# EAGLE schematic Masterprop (EAGLE 9.7.0)
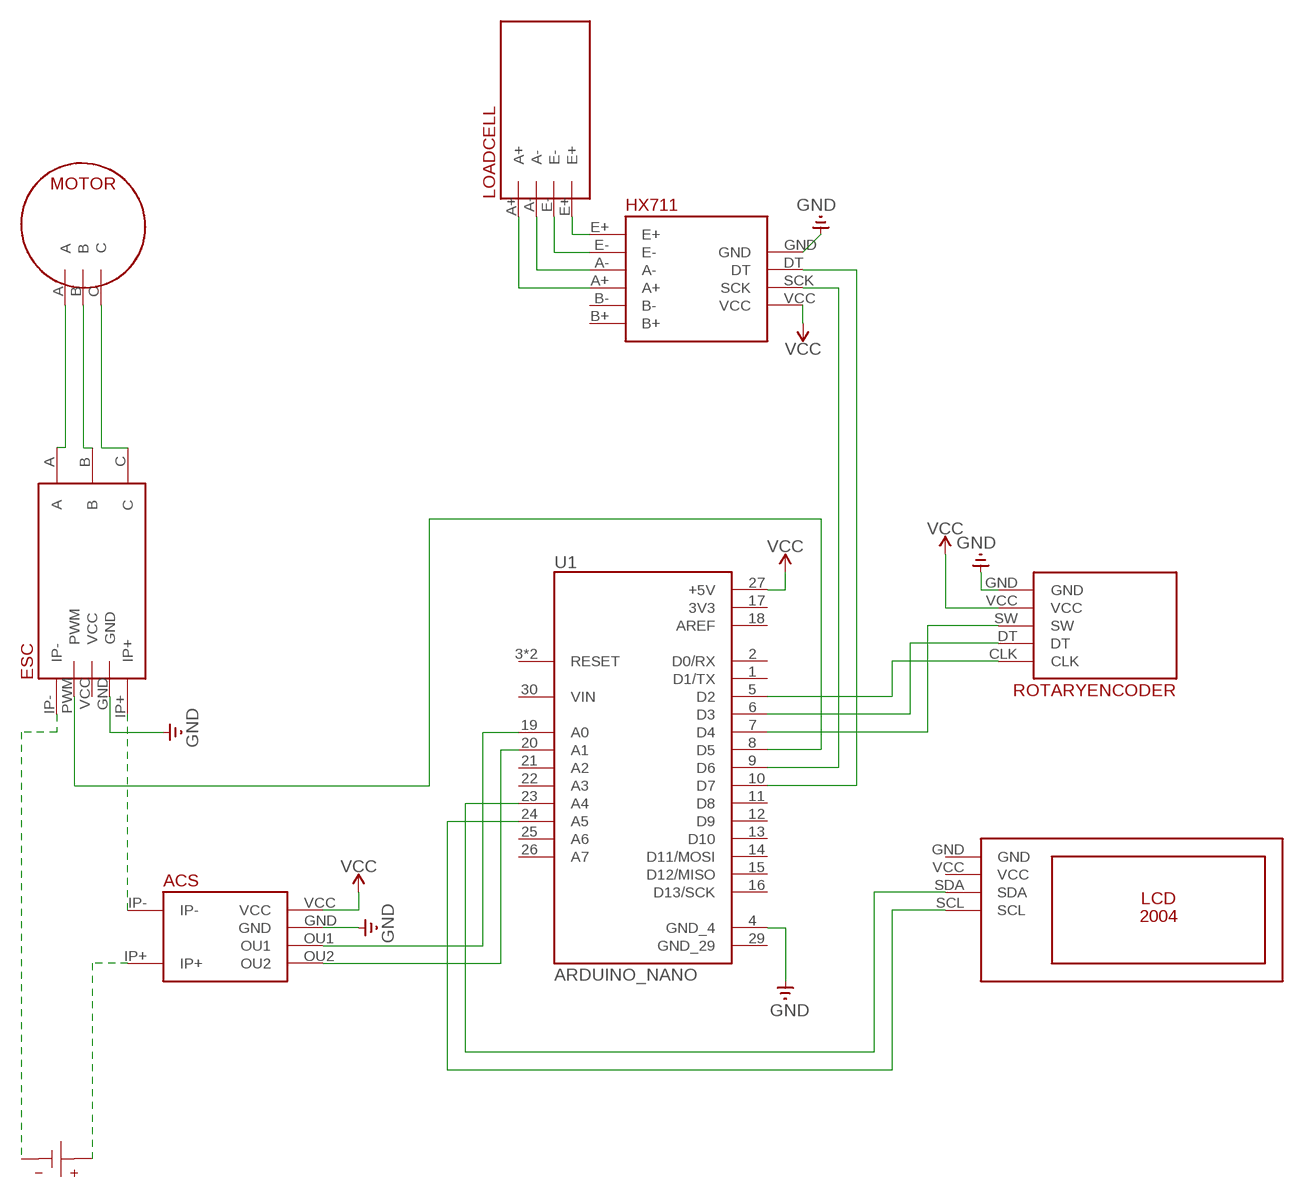
[diagram p0: schematic, sheet 1]

## Parts
BT1  KEYSTONE_1042  [1042]
U1  ARDUINO_NANO  [MODULE_ARDUINO_NANO]
U$1  ACSACS-FOOTPRINT  [ACS-FOOTPRINT]
U$2  ESCESC-FOOTPRINT  [ESC-FOOTPRINT]
U$3  HX711HX711-FOOTPRINT  [HX711-FOOTPRINT]
U$4  LOADCELLLOADCELL-FOOTPRINT  [LOADCELL-FOOTPRINT]
U$5  ROTARYENCODERROTARYENCODER-FOOTPRINT  [ROTARYENCODER-FOOTPRINT]
U$6  MOTORMOTOR-FOOTPRINT  [MOTOR-FOOTPRINT]
U$7  LCDLCD-FOOTPRINT  [LCD-FOOTPRINT]

## Nets
+: BT1.P(+) U$1.IP+
-: BT1.N(-) U$2.IP-
GND: U1.4(GND_4) U$1.GND U$2.GND U$3.GND U$5.GND
N$1: U1.8(D5) U$2.PWM
N$2: U1.5(D2) U$5.CLK
N$3: U1.10(D7) U$3.DT
N$4: U1.9(D6) U$3.SCK
N$5: U$1.IP- U$2.IP+
N$8: U$3.E+ U$4.E+
N$9: U$3.E- U$4.E-
N$10: U$3.A- U$4.A-
N$11: U$3.A+ U$4.A+
N$12: U$2.C U$6.C
N$13: U$2.B U$6.B
N$14: U$2.A U$6.A
N$15: U1.6(D3) U$5.DT
N$16: U1.7(D4) U$5.SW
N$17: U1.19(A0) U$1.OU1
N$18: U1.20(A1) U$1.OU2
N$19: U1.23(A4) U$7.SDA
N$20: U1.24(A5) U$7.SCL
VCC: U1.27(+5V) U$1.VCC U$3.VCC U$5.VCC
Unconnected: U1.1(D1/TX) U1.2(D0/RX) U1.3(RESET) U1.11(D8) U1.12(D9) U1.13(D10) U1.14(D11/MOSI) U1.15(D12/MISO) U1.16(D13/SCK) U1.21(A2) U1.22(A3) U1.25(A6) U1.26(A7) U1.28(RESET) U1.30(VIN) U$2.VCC U$3.B+ U$3.B- U$7.GND U$7.VCC

## Power pins joined to a net without a drawn wire
3V3: U1.17(3V3)
AREF: U1.18(AREF)
GND_29: U1.29(GND_29)

## Library data of the parts
BT1 = Battery_Holder:KEYSTONE_?: Keystone’s Single Cell Battery Holders; CATEGORY_L1: Battery Holders; CATEGORY_L2: Cylindrical Holder; CATEGORY_L3: Holder (Open); DATASHEET: https://www.keyelco.com/userAssets/file/K75p29.pdf; DESCRIPTION: Battery Holder (Open) 18650 1 Cell SMD (SMT) Tab Leaf Springs Height 0.585" (14.86mm); MANUFACTURER: Keystone Electronics; MAXTEMP: 145 C; MPN: 1042; OPERATING_TEMPERATURE: -50°C ~ 145°C; PACKAGE: Surface Mount; PACKAGE_SIZE: 18650; PART_STATUS: Active; ROHS: Compliant; VENDOR: Digikey; VPN: 36-1042-ND
U1 = ARDUINO_NANO:ARDUINO_NANO: Check availability <https://pricing.snapeda.com/parts/Arduino%20Nano/Arduino/view-part?ref=eda>; AVAILABILITY: Not in stock; CHECK_PRICES: https://www.snapeda.com/parts/Arduino%20Nano/Arduino/view-part/?ref=eda; DESCRIPTION: Small, complete, and breadboard-friendly board based on the ATmega328 (Arduino Nano 3.x); MF: Arduino; MP: Arduino Nano; PACKAGE: Non-Standard Arduino; PRICE: None; SNAPEDA_LINK: https://www.snapeda.com/parts/Arduino%20Nano/Arduino/view-part/?ref=snap
U$1 = MASTERPROP:ACS
U$2 = MASTERPROP:ESC
U$3 = MASTERPROP:HX711
U$4 = MASTERPROP:LOADCELL
U$5 = MASTERPROP:ROTARYENCODER
U$6 = MASTERPROP:MOTOR
U$7 = MASTERPROP:LCD